# Altium schematic sheet RELAY_BOARD_V1.SchDoc
size A3
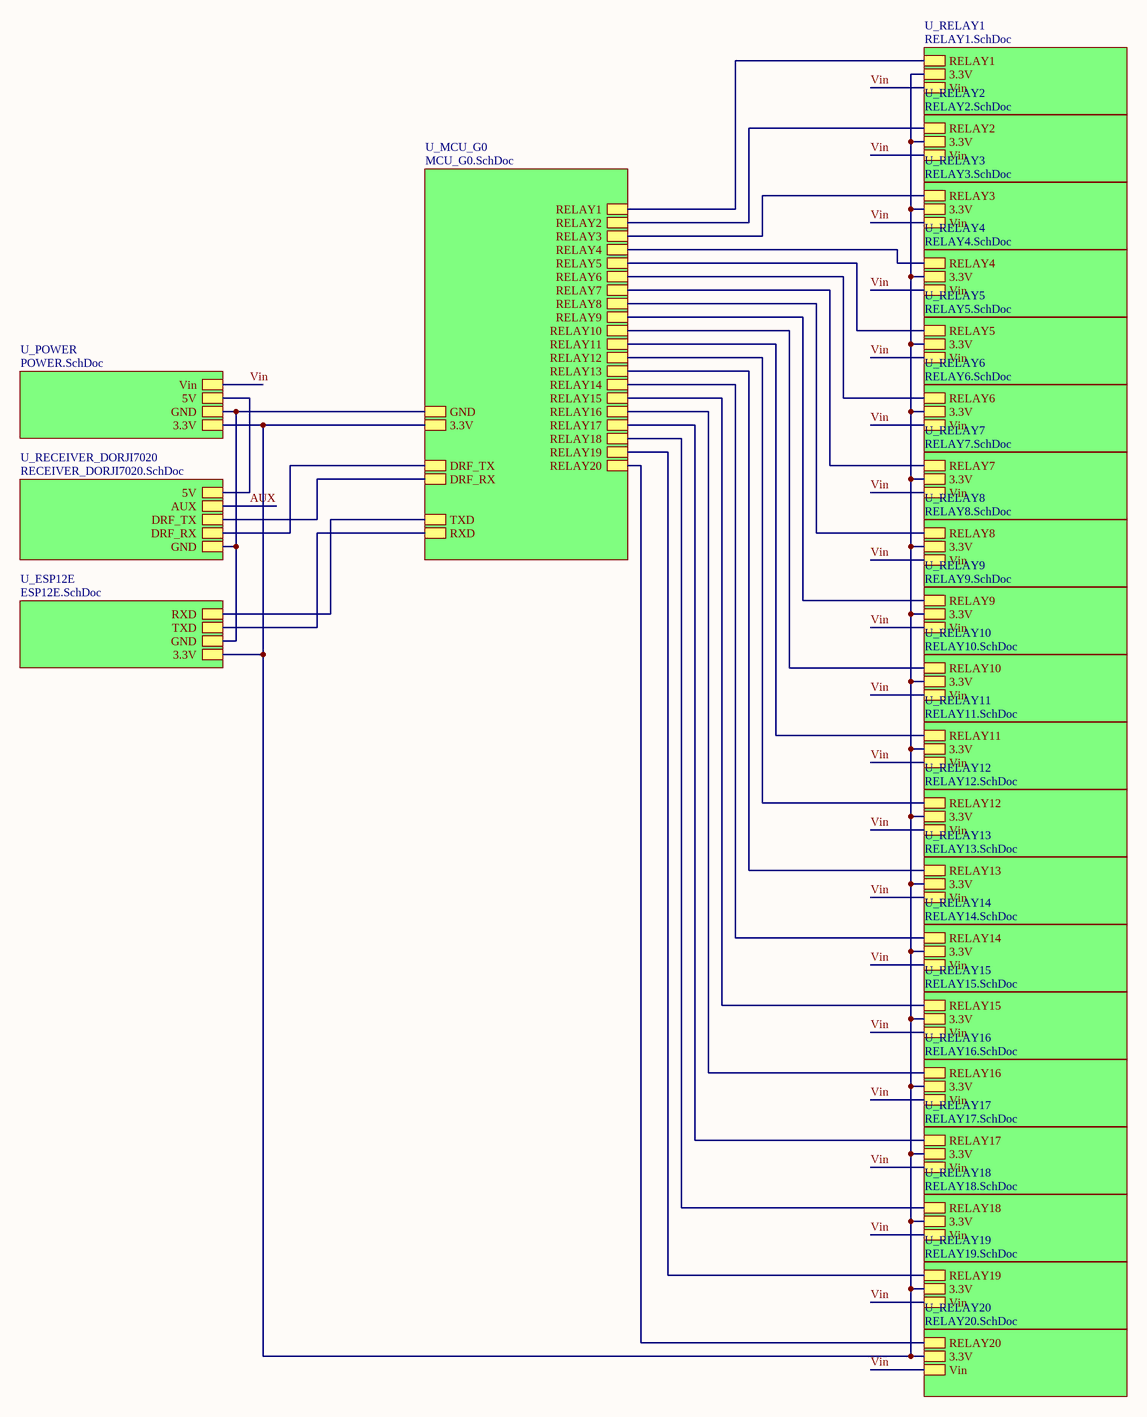
[diagram p0: RELAY_BOARD_V1.SchDoc]

## Sub-sheets
U_ESP12E = ESP12E.SchDoc: RXD, TXD, GND, 3.3V
U_MCU_G0 = MCU_G0.SchDoc: DRF_TX, DRF_RX, TXD, RXD, 3.3V, GND, RELAY1, RELAY3, RELAY2, RELAY4, RELAY5, RELAY6, RELAY7, RELAY8, RELAY10, RELAY9, RELAY11, RELAY12, RELAY13, RELAY14, RELAY15, RELAY16, RELAY17, RELAY18, RELAY19, RELAY20
U_POWER = POWER.SchDoc: Vin, 5V, GND, 3.3V
U_RECEIVER_DORJI7020 = RECEIVER_DORJI7020.SchDoc: 5V, AUX, DRF_TX, DRF_RX, GND
U_RELAY1 = RELAY1.SchDoc: RELAY1, 3.3V, Vin
U_RELAY2 = RELAY2.SchDoc: RELAY2, 3.3V, Vin
U_RELAY3 = RELAY3.SchDoc: RELAY3, 3.3V, Vin
U_RELAY4 = RELAY4.SchDoc: RELAY4, 3.3V, Vin
U_RELAY5 = RELAY5.SchDoc: RELAY5, 3.3V, Vin
U_RELAY6 = RELAY6.SchDoc: RELAY6, 3.3V, Vin
U_RELAY7 = RELAY7.SchDoc: RELAY7, 3.3V, Vin
U_RELAY8 = RELAY8.SchDoc: RELAY8, 3.3V, Vin
U_RELAY9 = RELAY9.SchDoc: RELAY9, 3.3V, Vin
U_RELAY10 = RELAY10.SchDoc: RELAY10, 3.3V, Vin
U_RELAY11 = RELAY11.SchDoc: RELAY11, 3.3V, Vin
U_RELAY12 = RELAY12.SchDoc: RELAY12, 3.3V, Vin
U_RELAY13 = RELAY13.SchDoc: RELAY13, 3.3V, Vin
U_RELAY14 = RELAY14.SchDoc: RELAY14, 3.3V, Vin
U_RELAY15 = RELAY15.SchDoc: RELAY15, 3.3V, Vin
U_RELAY16 = RELAY16.SchDoc: RELAY16, 3.3V, Vin
U_RELAY17 = RELAY17.SchDoc: RELAY17, 3.3V, Vin
U_RELAY18 = RELAY18.SchDoc: RELAY18, 3.3V, Vin
U_RELAY19 = RELAY19.SchDoc: RELAY19, 3.3V, Vin
U_RELAY20 = RELAY20.SchDoc: RELAY20, 3.3V, Vin

## Nets
AUX: sheet U_RECEIVER_DORJI7020/AUX
Vin: sheet U_POWER/Vin, sheet U_RELAY1/Vin, sheet U_RELAY2/Vin, sheet U_RELAY3/Vin, sheet U_RELAY4/Vin, sheet U_RELAY5/Vin, sheet U_RELAY6/Vin, sheet U_RELAY7/Vin, sheet U_RELAY8/Vin, sheet U_RELAY9/Vin, sheet U_RELAY10/Vin, sheet U_RELAY11/Vin, sheet U_RELAY12/Vin, sheet U_RELAY13/Vin, sheet U_RELAY14/Vin, sheet U_RELAY15/Vin, sheet U_RELAY16/Vin, sheet U_RELAY17/Vin, sheet U_RELAY18/Vin, sheet U_RELAY19/Vin, sheet U_RELAY20/Vin
(unnamed): sheet U_MCU_G0/DRF_TX, sheet U_RECEIVER_DORJI7020/DRF_RX
(unnamed): sheet U_MCU_G0/DRF_RX, sheet U_RECEIVER_DORJI7020/DRF_TX
(unnamed): sheet U_MCU_G0/TXD, sheet U_ESP12E/RXD
(unnamed): sheet U_MCU_G0/RXD, sheet U_ESP12E/TXD
(unnamed): sheet U_MCU_G0/3.3V, sheet U_ESP12E/3.3V, sheet U_POWER/3.3V, sheet U_RELAY1/3.3V, sheet U_RELAY2/3.3V, sheet U_RELAY3/3.3V, sheet U_RELAY4/3.3V, sheet U_RELAY5/3.3V, sheet U_RELAY6/3.3V, sheet U_RELAY7/3.3V, sheet U_RELAY8/3.3V, sheet U_RELAY9/3.3V, sheet U_RELAY10/3.3V, sheet U_RELAY11/3.3V, sheet U_RELAY12/3.3V, sheet U_RELAY13/3.3V, sheet U_RELAY14/3.3V, sheet U_RELAY15/3.3V, sheet U_RELAY16/3.3V, sheet U_RELAY17/3.3V, sheet U_RELAY18/3.3V, sheet U_RELAY19/3.3V, sheet U_RELAY20/3.3V
(unnamed): sheet U_MCU_G0/GND, sheet U_RECEIVER_DORJI7020/GND, sheet U_ESP12E/GND, sheet U_POWER/GND
(unnamed): sheet U_MCU_G0/RELAY1, sheet U_RELAY1/RELAY1
(unnamed): sheet U_MCU_G0/RELAY3, sheet U_RELAY3/RELAY3
(unnamed): sheet U_MCU_G0/RELAY2, sheet U_RELAY2/RELAY2
(unnamed): sheet U_MCU_G0/RELAY4, sheet U_RELAY4/RELAY4
(unnamed): sheet U_MCU_G0/RELAY5, sheet U_RELAY5/RELAY5
(unnamed): sheet U_MCU_G0/RELAY6, sheet U_RELAY6/RELAY6
(unnamed): sheet U_MCU_G0/RELAY7, sheet U_RELAY7/RELAY7
(unnamed): sheet U_MCU_G0/RELAY8, sheet U_RELAY8/RELAY8
(unnamed): sheet U_MCU_G0/RELAY10, sheet U_RELAY10/RELAY10
(unnamed): sheet U_MCU_G0/RELAY9, sheet U_RELAY9/RELAY9
(unnamed): sheet U_MCU_G0/RELAY11, sheet U_RELAY11/RELAY11
(unnamed): sheet U_MCU_G0/RELAY12, sheet U_RELAY12/RELAY12
(unnamed): sheet U_MCU_G0/RELAY13, sheet U_RELAY13/RELAY13
(unnamed): sheet U_MCU_G0/RELAY14, sheet U_RELAY14/RELAY14
(unnamed): sheet U_MCU_G0/RELAY15, sheet U_RELAY15/RELAY15
(unnamed): sheet U_MCU_G0/RELAY16, sheet U_RELAY16/RELAY16
(unnamed): sheet U_MCU_G0/RELAY17, sheet U_RELAY17/RELAY17
(unnamed): sheet U_MCU_G0/RELAY18, sheet U_RELAY18/RELAY18
(unnamed): sheet U_MCU_G0/RELAY19, sheet U_RELAY19/RELAY19
(unnamed): sheet U_MCU_G0/RELAY20, sheet U_RELAY20/RELAY20
(unnamed): sheet U_RECEIVER_DORJI7020/5V, sheet U_POWER/5V